# Altium schematic sheet high power amplifier module.SchDoc: High Power Amplifier Module (HPAM)
size A4; Date: 2014-12-21; Author: Artur Scholz; DocumentNumber: LibreCube LC23-01a
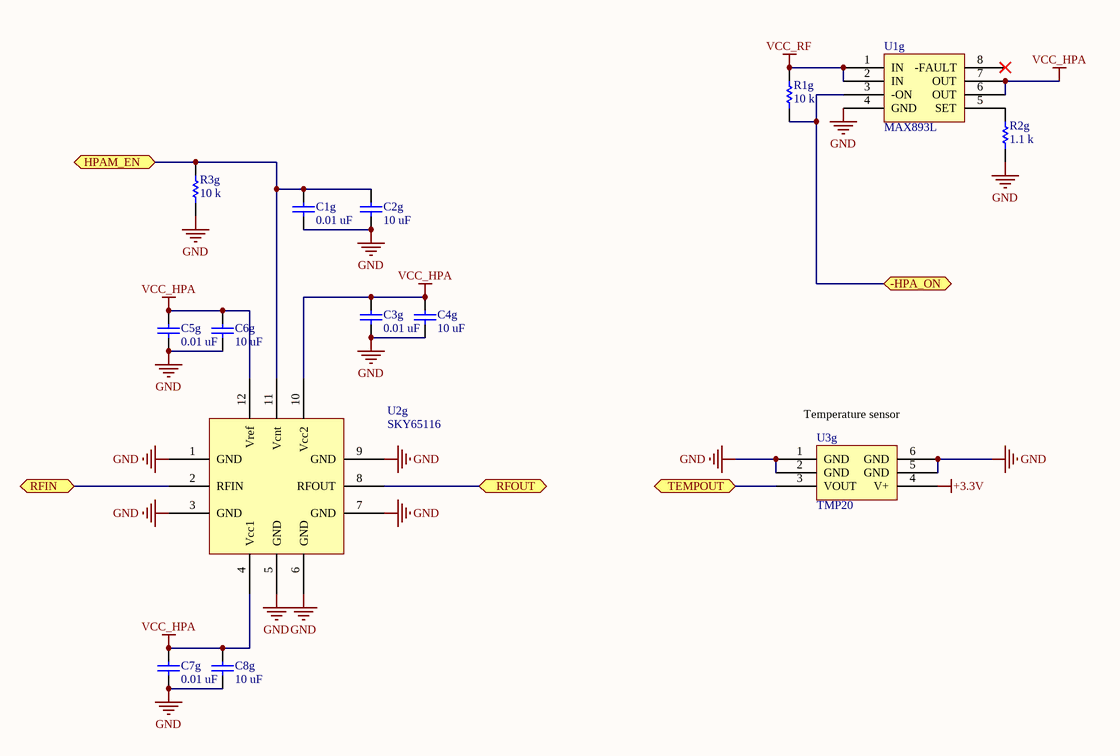
[diagram p0: high power amplifier module.SchDoc]

## Parts
C1g  0.01 uF  [0603]
C2g  10 uF  [1206]
C3g  0.01 uF  [0603]
C4g  10 uF  [1206]
C5g  0.01 uF  [0603]
C6g  10 uF  [1206]
C7g  0.01 uF  [0603]
C8g  10 uF  [1206]
R1g  10 k  [0603]
R2g  1.1 k  [0603]
R3g  10 k  [0603]
U1g  MAX893L  [SO-8]
U2g  SKY65116  [MCM-12]
U3g  TMP20  [SOT563-6]

## Ports
-HPA_ON, HPAM_EN, RFIN, RFOUT, TEMPOUT

## Nets
+3.3V: U3g.4(V+)
GND: C1g.1 C2g.1 C3g.1 C4g.1 C5g.1 C6g.1 C7g.1 C8g.1 R2g.2 R3g.1 U1g.4(GND) U2g.1(GND) U2g.3(GND) U2g.5(GND) U2g.6(GND) U2g.7(GND) U2g.9(GND) U3g.1(GND) U3g.2(GND) U3g.5(GND) U3g.6(GND)
VCC_HPA: C3g.2 C4g.2 C5g.2 C6g.2 C7g.2 C8g.2 U1g.6(OUT) U1g.7(OUT) U2g.4(Vcc1) U2g.10(Vcc2) U2g.12(Vref)
VCC_RF: R1g.1 U1g.1(IN) U1g.2(IN)
-HPA_ON: R1g.2 U1g.3(-ON) ; port -HPA_ON
HPAM_EN: C1g.2 C2g.2 R3g.2 U2g.11(Vcnt) ; port HPAM_EN
RFIN: U2g.2(RFIN) ; port RFIN
RFOUT: U2g.8(RFOUT) ; port RFOUT
TEMPOUT: U3g.3(VOUT) ; port TEMPOUT
NetR2g_1: R2g.1 U1g.5(SET)

Not connected (* = marked no-connect by the designer): U1g 8(-FAULT)*

## Notes on the sheet
- (near U3g) Temperature sensor

## Library data of the parts
C1g C2g C3g C4g C5g C6g C7g C8g = Capacitor
R1g R2g R3g = Resistor
U2g = SKY65116: Linear RF Power Amplifier